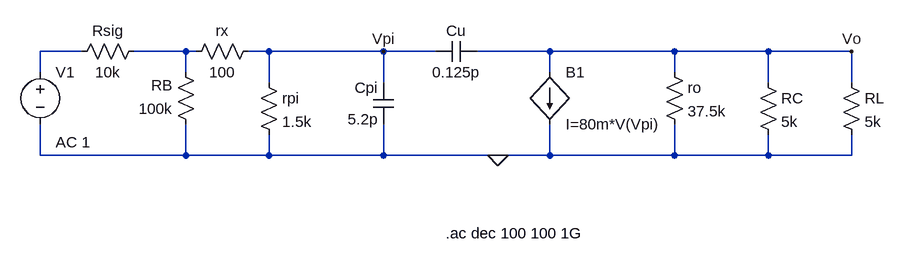
[diagram p0: schematic BJT Loaded.asc]
BJT Loaded.asc, the LTspice schematic file:
Version 4.1
SHEET 1 880 680
WIRE -384 128 -448 128
WIRE -224 128 -304 128
WIRE -208 128 -224 128
WIRE -96 128 -128 128
WIRE 80 128 -96 128
WIRE 160 128 80 128
WIRE 336 128 224 128
WIRE 528 128 336 128
WIRE 672 128 528 128
WIRE 800 128 672 128
WIRE -448 160 -448 128
WIRE -224 160 -224 128
WIRE 336 160 336 128
WIRE 528 160 528 128
WIRE -96 176 -96 128
WIRE 80 176 80 128
WIRE 672 176 672 128
WIRE 800 176 800 128
WIRE -448 288 -448 240
WIRE -224 288 -224 240
WIRE -224 288 -448 288
WIRE -96 288 -96 256
WIRE -96 288 -224 288
WIRE 80 288 80 240
WIRE 80 288 -96 288
WIRE 256 288 80 288
WIRE 336 288 336 240
WIRE 336 288 256 288
WIRE 528 288 528 240
WIRE 528 288 336 288
WIRE 672 288 672 256
WIRE 672 288 528 288
WIRE 800 288 800 256
WIRE 800 288 672 288
FLAG 256 288 0
FLAG 80 128 Vpi
FLAG 800 128 Vo
SYMBOL cap 224 112 R90
WINDOW 0 0 32 VBottom 2
WINDOW 3 32 32 VTop 2
SYMATTR InstName Cu
SYMATTR Value 0.125p
SYMBOL cap 96 240 R180
WINDOW 0 24 56 Left 2
WINDOW 3 24 8 Left 2
SYMATTR InstName Cpi
SYMATTR Value 5.2p
SYMBOL res 512 144 R0
SYMATTR InstName ro
SYMATTR Value 37.5k
SYMBOL bi 336 160 R0
SYMATTR InstName B1
SYMATTR Value I=80m*V(Vpi)
SYMBOL res -112 160 R0
SYMATTR InstName rpi
SYMATTR Value 1.5k
SYMBOL res -112 112 R90
WINDOW 0 0 56 VBottom 2
WINDOW 3 32 56 VTop 2
SYMATTR InstName rx
SYMATTR Value 100
SYMBOL res -208 256 R180
WINDOW 0 36 76 Left 2
WINDOW 3 36 40 Left 2
SYMATTR InstName RB
SYMATTR Value 100k
SYMBOL res -400 144 R270
WINDOW 0 32 56 VTop 2
WINDOW 3 0 56 VBottom 2
SYMATTR InstName Rsig
SYMATTR Value 10k
SYMBOL voltage -448 144 R0
WINDOW 123 24 124 Left 2
WINDOW 39 0 0 Left 0
SYMATTR InstName V1
SYMATTR Value ""
SYMATTR Value2 AC 1
SYMBOL res 656 160 R0
SYMATTR InstName RC
SYMATTR Value 5k
SYMBOL res 784 160 R0
SYMATTR InstName RL
SYMATTR Value 5k
TEXT 176 408 Left 2 !.ac dec 100 100 1G

The netlist it stands for:
* BJT Loaded.asc
Cu Vo Vpi 0.125p
Cpi 0 Vpi 5.2p
ro Vo 0 37.5k
B1 Vo 0 I=80m*V(Vpi)
rpi Vpi 0 1.5k
rx Vpi N002 100
RB 0 N002 100k
Rsig N001 N002 10k
V1 N001 0 AC 1
RC Vo 0 5k
RL Vo 0 5k
.ac dec 100 100 1G
.backanno
.end